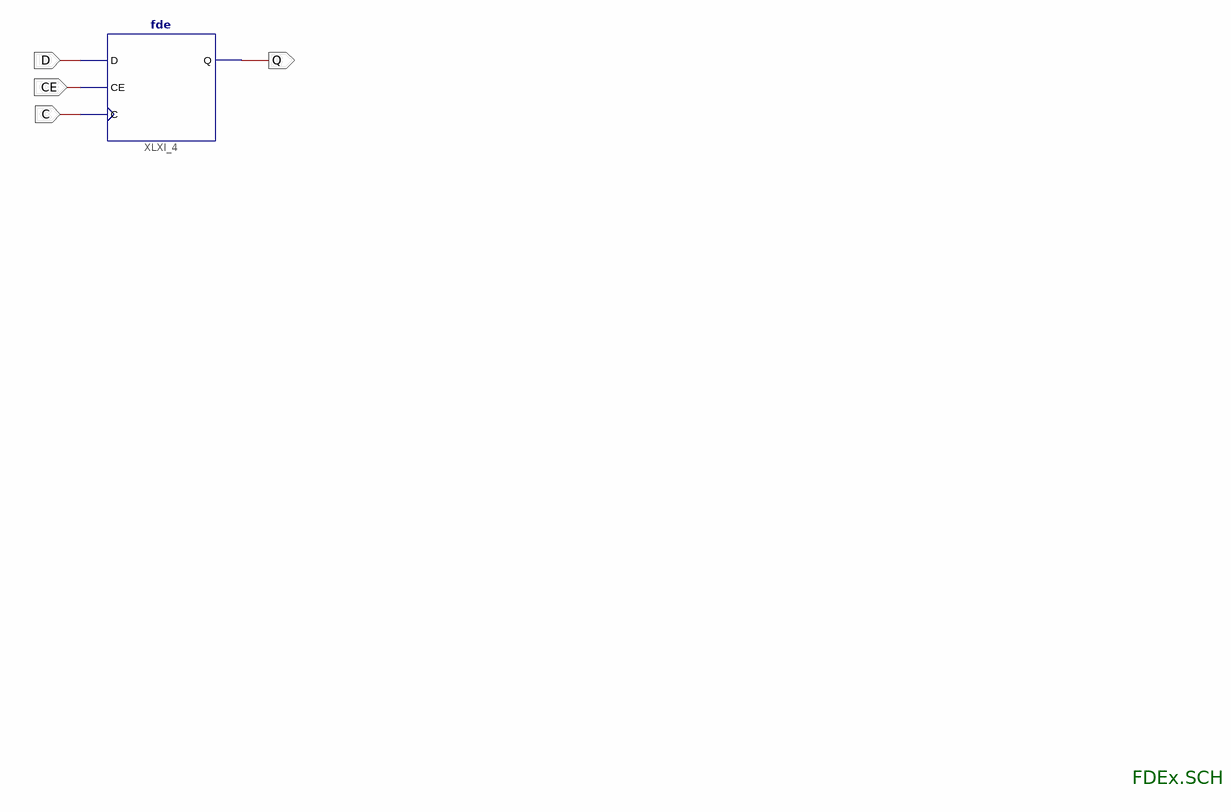
[diagram p0: schematic sheet 1]
// Xilinx ISE schematic FDEx.sch (spartan3e) as structural Verilog: 1 symbols, 4 ports
module FDEx (
  input  D,
  input  C,
  input  CE,
  output Q
);

  fde XLXI_4 (.C(C), .CE(CE), .D(D), .Q(Q));

  // Notes on the sheet:
  //   FDEx.SCH
endmodule
